# EAGLE design FlipdotMini (EAGLE 6.4)
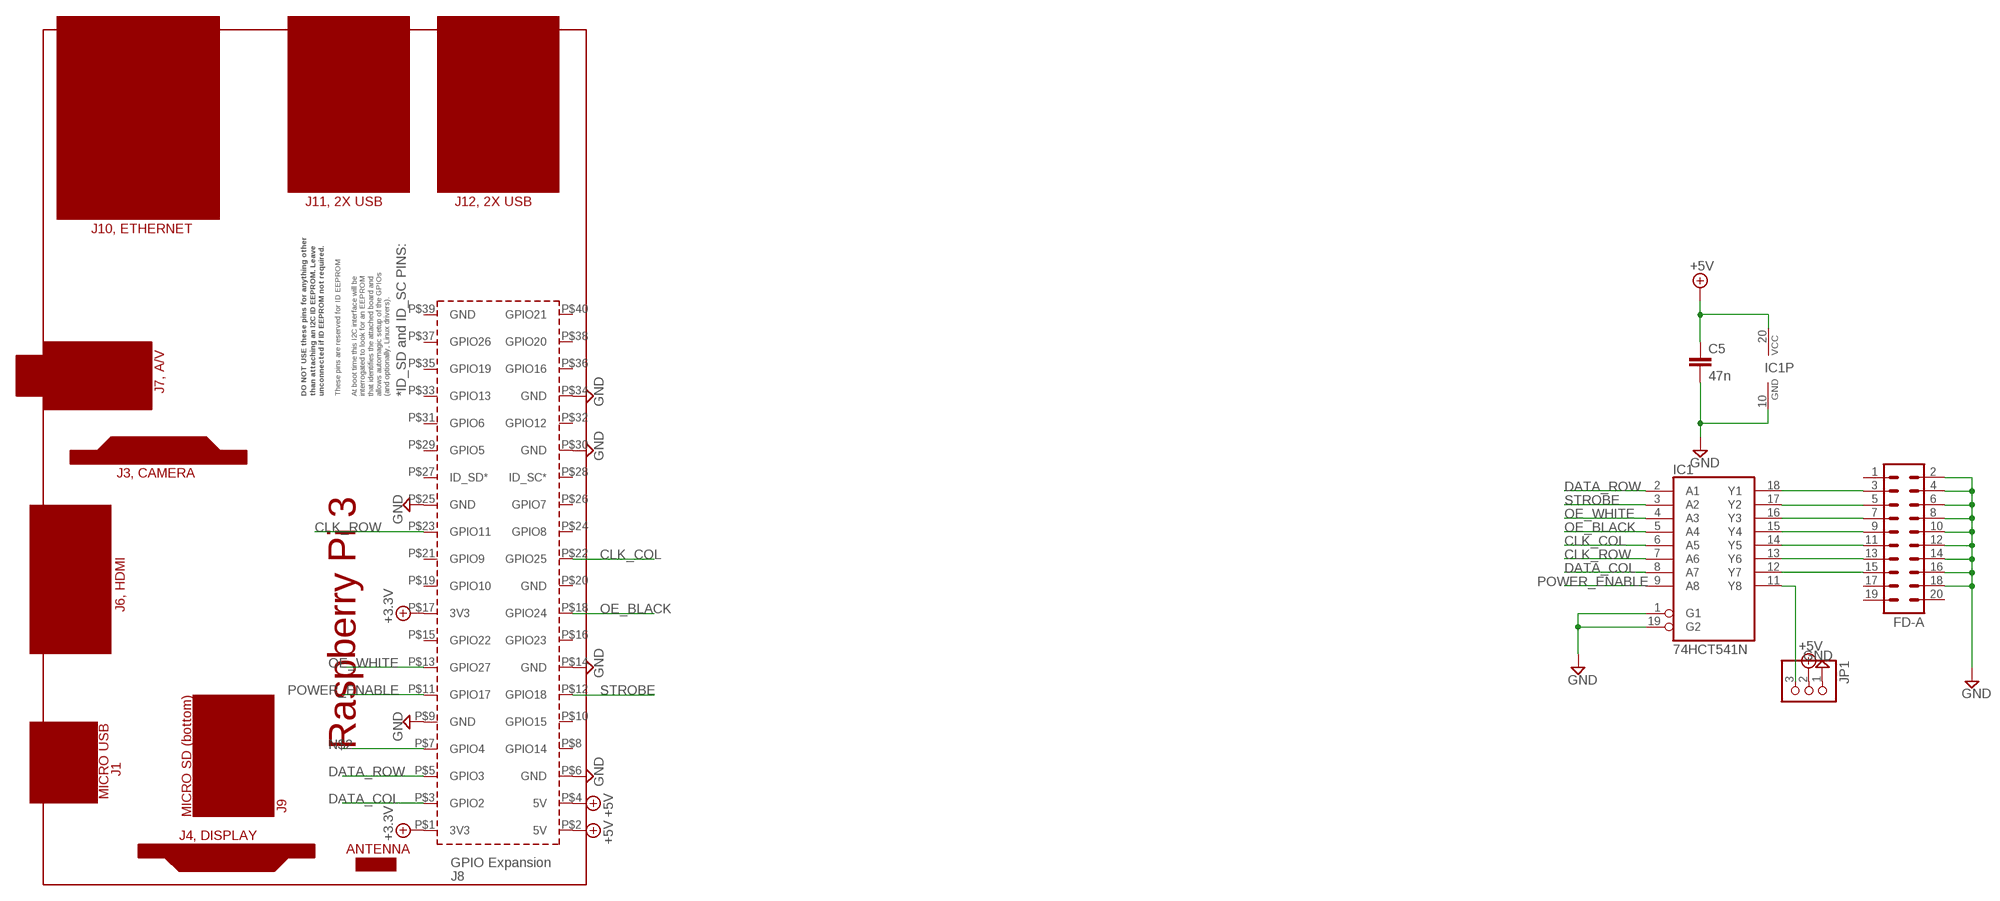
[diagram p0: schematic, sheet 1]

## Parts
C5  47n  C-EUC0805  [C0805]
FD-A  MA10-2  [MA10-2]
IC1  74HCT541N  [DIL20]
JP1  PINHD-1X3  [1X03]
PCB1  RPI3  [RPI3]

## Nets
+3.3V: PCB1.P$1(3V3) PCB1.P$17(3V3)
+5V: C5.1 IC1.20(VCC) JP1.2 PCB1.P$2(5V) PCB1.P$4(5V)
CLK_COL: IC1.6(A5) PCB1.P$22(GPIO25)
CLK_ROW: IC1.7(A6) PCB1.P$23(GPIO11)
DATA_COL: IC1.8(A7) PCB1.P$3(GPIO2)
DATA_ROW: IC1.2(A1) PCB1.P$5(GPIO3)
GND: C5.2 FD-A.2 FD-A.4 FD-A.6 FD-A.8 FD-A.10 FD-A.12 FD-A.14 FD-A.16 FD-A.18 IC1.1(G1) IC1.10(GND) IC1.19(G2) JP1.1 PCB1.P$6(GND) PCB1.P$9(GND) PCB1.P$14(GND) PCB1.P$25(GND) PCB1.P$30(GND) PCB1.P$34(GND)
N$1: FD-A.3 IC1.18(Y1)
N$2: PCB1.P$7(GPIO4)
N$3: FD-A.5 IC1.17(Y2)
N$4: FD-A.7 IC1.16(Y3)
N$5: FD-A.9 IC1.15(Y4)
N$6: FD-A.11 IC1.14(Y5)
N$7: FD-A.13 IC1.13(Y6)
N$8: FD-A.15 IC1.12(Y7)
N$9: IC1.11(Y8) JP1.3
OE_BLACK: IC1.5(A4) PCB1.P$18(GPIO24)
OE_WHITE: IC1.4(A3) PCB1.P$13(GPIO27)
POWER_ENABLE: IC1.9(A8) PCB1.P$11(GPIO17)
STROBE: IC1.3(A2) PCB1.P$12(GPIO18)
Unconnected: FD-A.1 FD-A.17 FD-A.19 FD-A.20 PCB1.P$8(GPIO14) PCB1.P$10(GPIO15) PCB1.P$15(GPIO22) PCB1.P$16(GPIO23) PCB1.P$19(GPIO10) PCB1.P$20(GND) PCB1.P$21(GPIO9) PCB1.P$24(GPIO8) PCB1.P$26(GPIO7) PCB1.P$27(ID_SD*) PCB1.P$28(ID_SC*) PCB1.P$29(GPIO5) PCB1.P$31(GPIO6) PCB1.P$32(GPIO12) PCB1.P$33(GPIO13) PCB1.P$35(GPIO19) PCB1.P$36(GPIO16) PCB1.P$37(GPIO26) PCB1.P$38(GPIO20) PCB1.P$39(GND) PCB1.P$40(GPIO21)

## Library data of the parts
C5 = rcl:C-EU: CAPACITOR, European symbol
FD-A = con-lstb:MA10-2: PIN HEADER; OC_FARNELL: unknown; OC_NEWARK: unknown
IC1 = 74xx-eu:74*541: Octal BUFFER and LINE DRIVER, 3-state
JP1 = pinhead:PINHD-1X3: PIN HEADER
PCB1 = e14_Rpi3_RevA:RPI3: Device for Raspberry Pi 3 board created by Dave Young for www.element14.com More information and support community is available at https://www.element14.com/community/community/raspberry-pi

## Board
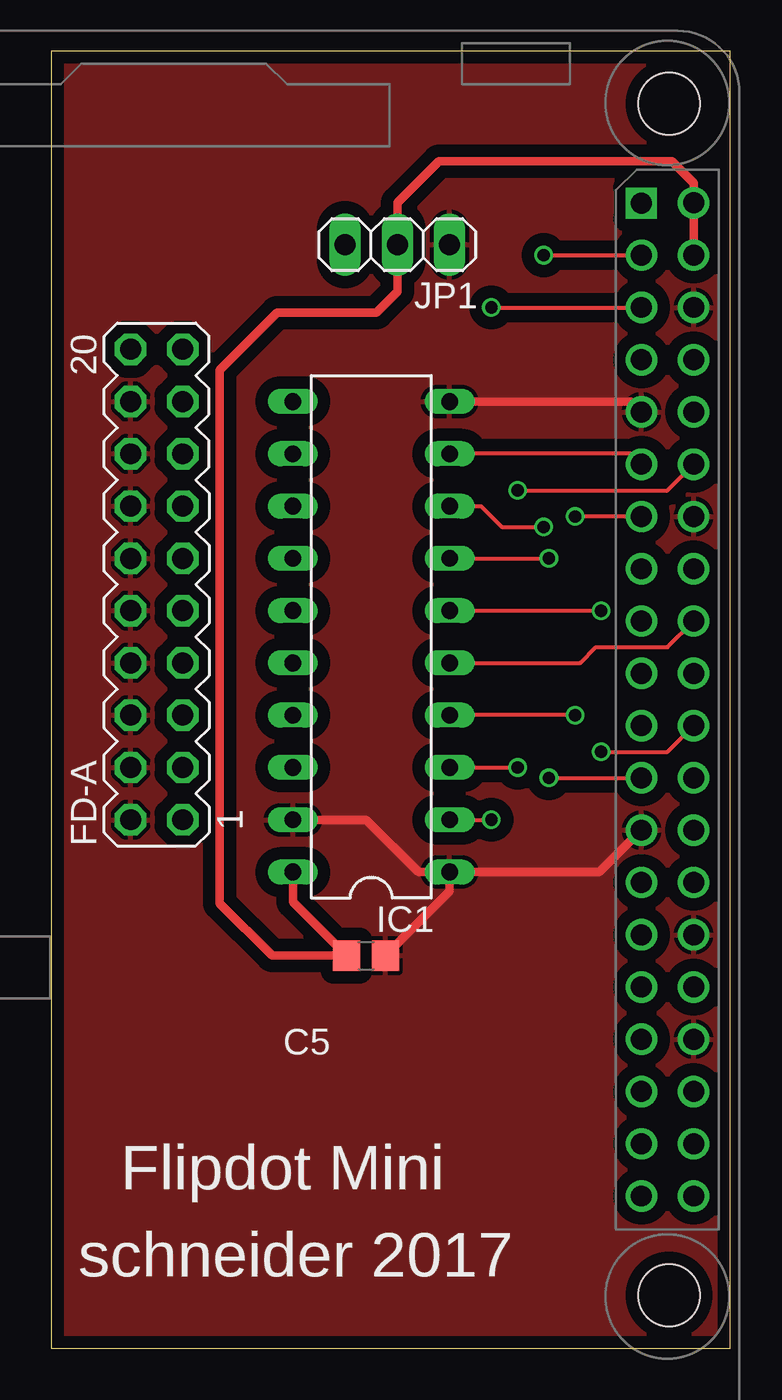
[diagram p1: board, top side]
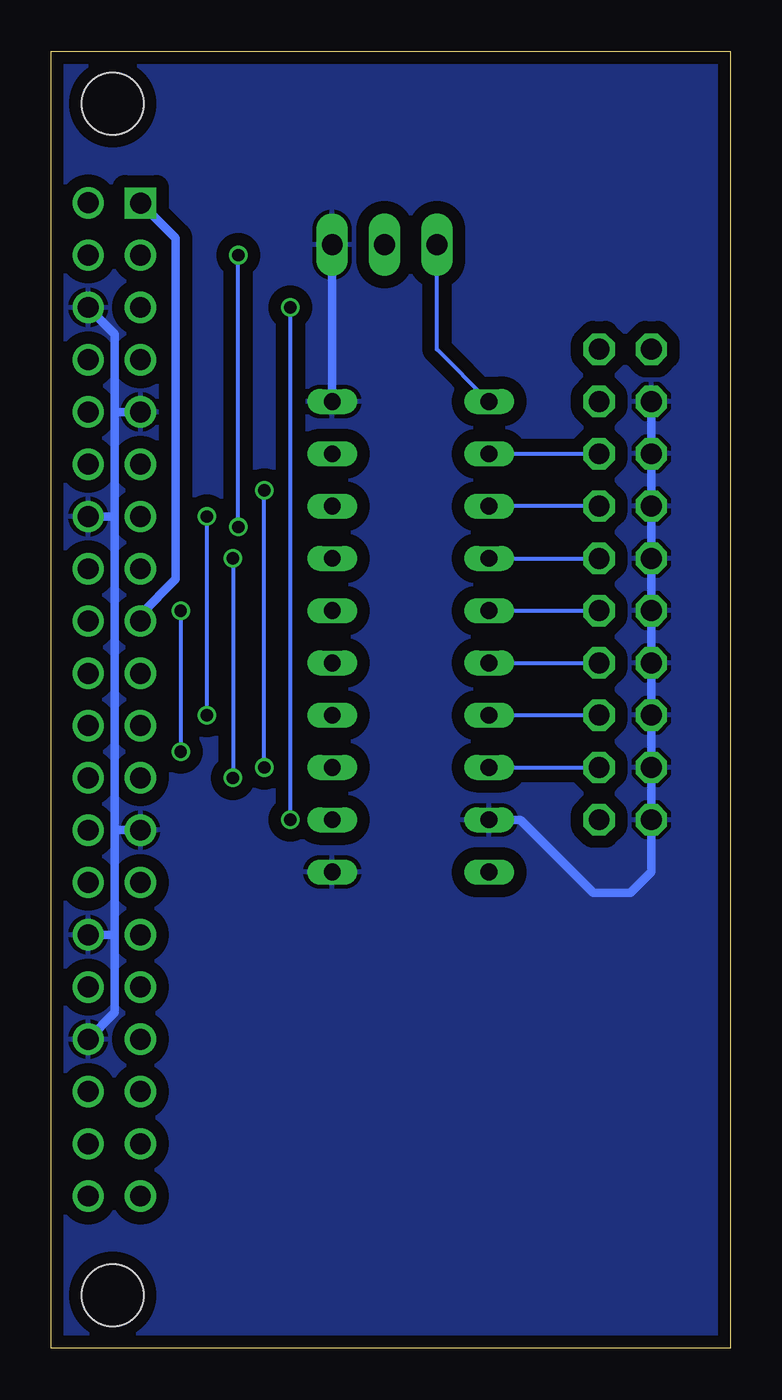
[diagram p2: board, bottom side, seen from below]

Size 33 x 63 mm. Coordinates in mm from the lower left corner, seen from the top.
Outline: 0,0 33,0 33,63 0,63 0,0
Copper layers (1*16): Top 0.018mm / dielectric 1.55mm / Bottom 0.018mm
Design rules "Multi-CB_2L_125um-Tracks_OL35um": minimum track width 0.125mm, minimum drill 0.2mm, track to track 0.125mm, track to pad 0.125mm, pad to pad 0.125mm, via to via 0.125mm, smd to smd 0mil, copper to edge 0.2mm, drill to drill 0.2mm, minimum pad ring 0.125mm, minimum via ring 0.125mm, stop-mask expansion 2mil, vias tented up to drill 0.45mm, thermal gap 0.2mm
Holes 3 mm at 30.02,60.47 30.02,2.56

### Footprints (pad centres in the part's own frame; a part is rotated, then mirrored left to right if it is on the bottom)
C0805 = smd 1.3 x 1.5: 1 -0.95,0; 2 0.95,0
MA10-2 = drill 1.016 octagon: 1 -11.43,-1.27; 2 -11.43,1.27; 3 -8.89,-1.27; 4 -8.89,1.27; 5 -6.35,-1.27; 6 -6.35,1.27; 7 -3.81,-1.27; 8 -3.81,1.27; 9 -1.27,-1.27; 10 -1.27,1.27; 11 1.27,-1.27; 12 1.27,1.27; 13 3.81,-1.27; 14 3.81,1.27; 15 6.35,-1.27; 16 6.35,1.27; 17 8.89,-1.27; 18 8.89,1.27; 19 11.43,-1.27; 20 11.43,1.27
DIL20 = drill 0.813 long: 1 -11.43,-3.81; 2 -8.89,-3.81; 3 -6.35,-3.81; 4 -3.81,-3.81; 5 -1.27,-3.81; 6 1.27,-3.81; 7 3.81,-3.81; 8 6.35,-3.81; 9 8.89,-3.81; 10 11.43,-3.81; 11 11.43,3.81; 12 8.89,3.81; 13 6.35,3.81; 14 3.81,3.81; 15 1.27,3.81; 16 -1.27,3.81; 17 -3.81,3.81; 18 -6.35,3.81; 19 -8.89,3.81; 20 -11.43,3.81
1X03 = drill 1.016 long: 1 -2.54,0; 2 0,0; 3 2.54,0
RPI3 = drill 1.016 square: P$1 8.37,51.23 | drill 1.016: P$2 8.357,53.772; P$3 10.897,51.232; P$4 10.897,53.772; P$5 13.437,51.232; P$6 13.437,53.772; P$7 15.977,51.232; P$8 15.977,53.772; P$9 18.517,51.232; P$10 18.517,53.772; P$11 21.057,51.232; P$12 21.057,53.772; P$13 23.597,51.232; P$14 23.597,53.772; P$15 26.137,51.232; P$16 26.137,53.772; P$17 28.677,51.232; P$18 28.677,53.772; P$19 31.217,51.232; P$20 31.217,53.772; P$21 33.757,51.232; P$22 33.757,53.772; P$23 36.297,51.232; P$24 36.297,53.772; P$25 38.837,51.232; P$26 38.837,53.772; P$27 41.377,51.232; P$28 41.377,53.772; P$29 43.917,51.232; P$30 43.917,53.772; P$31 46.457,51.232; P$32 46.457,53.772; P$33 48.997,51.232; P$34 48.997,53.772; P$35 51.537,51.232; P$36 51.537,53.772; P$37 54.077,51.232; P$38 54.077,53.772; P$39 56.617,51.232; P$40 56.617,53.772

### Placement (x,y rotation side)
C5  15.29,19.07 0 top
FD-A  5.11,37.1 90 top
IC1  15.54,34.56 90 top
JP1  16.81,53.61 180 top
PCB1  -22.56,64 270 top

### Tracks (layer width: path | path; a pad name or v marks a point on that pad's centre or on a via)
+3.3V
  Bottom 0.406: PCB1.P$17 28.67,35.65 26.97,37.35 26.97,53.93 PCB1.P$1
+5V
  Top 0.406: IC1.20 11.73,21.67 C5.1 10.72,19.07 8.18,21.61 8.18,47.51 10.97,50.31 15.8,50.31 16.81,51.32 JP1.2 16.81,55.64 18.84,57.67 30.15,57.67 31.21,56.61 PCB1.P$2 PCB1.P$4
CLK_COL  (via drill 0.6)
  Top 0.203: IC1.6 v26.72,35.83 | v26.72,28.97 29.94,28.97 PCB1.P$22
  Bottom 0.203: v26.72,35.83 v26.72,28.97
CLK_ROW  (via drill 0.6)
  Top 0.203: IC1.7 v24.18,38.37 | v24.18,27.7 PCB1.P$23
  Bottom 0.203: v24.18,38.37 v24.18,27.7
DATA_COL  (via drill 0.6)
  Top 0.203: IC1.8 20.88,40.91 21.89,39.89 v23.92,39.89 | v23.92,53.1 PCB1.P$3
  Bottom 0.203: v23.92,39.89 v23.92,53.1
DATA_ROW  (via drill 0.6)
  Top 0.203: IC1.2 v21.38,25.67 | v21.38,50.56 PCB1.P$5
  Bottom 0.203: v21.38,25.67 v21.38,50.56
GND
  Top 0.406: PCB1.P$25 26.64,23.13 IC1.1 | IC1.10 28.17,45.99 PCB1.P$9 | C5.2 19.35,22.18 IC1.1 | IC1.19 15.29,25.67 17.83,23.13 IC1.1
  Bottom 0.406: PCB1.P$6 29.92,49.27 29.92,45.48 | 29.92,45.48 29.92,40.4 | 29.92,40.4 29.92,25.16 | 29.92,25.16 29.92,20.08 | 29.92,20.08 29.92,16.3 PCB1.P$34 | PCB1.P$30 29.92,20.08 | PCB1.P$14 29.92,40.4 | PCB1.P$9 29.92,45.48 | PCB1.P$25 29.92,25.16 | IC1.19 10.21,25.67 6.65,22.11 4.86,22.11 3.84,23.13 FD-A.2 FD-A.4 FD-A.6 FD-A.8 FD-A.10 FD-A.12 FD-A.14 FD-A.16 FD-A.18 | IC1.10 JP1.1
  pour Bottom (isolate 0.61): 39.61,-2.77 36.69,-3.54 -28.8,-4.54 -27.45,65.57 34.71,65.26 40.56,27.89 42.05,11.69 39.26,8.72 38.91,2.11
  pour Top (isolate 0.61): 39.61,-2.77 36.69,-3.54 -28.8,-4.54 -27.45,65.57 34.71,65.26 40.56,27.89 42.05,11.69 39.26,8.72 38.91,2.11
N$1
  Bottom 0.203: IC1.18 FD-A.3
N$3
  Bottom 0.203: IC1.17 FD-A.5
N$4
  Bottom 0.203: IC1.16 FD-A.7
N$5
  Bottom 0.203: IC1.15 FD-A.9
N$6
  Bottom 0.203: IC1.14 FD-A.11
N$7
  Bottom 0.203: FD-A.13 IC1.13
N$8
  Bottom 0.203: IC1.12 FD-A.15
N$9
  Bottom 0.203: IC1.11 14.27,48.53 JP1.3
OE_BLACK
  Top 0.203: IC1.5 25.7,33.29 26.46,34.05 29.94,34.05 PCB1.P$18
OE_WHITE  (via drill 0.6)
  Top 0.203: PCB1.P$13 v25.45,40.4 | v25.45,30.75 IC1.4
  Bottom 0.203: v25.45,40.4 v25.45,30.75
POWER_ENABLE
  Top 0.203: PCB1.P$11 28.17,43.45 IC1.9
STROBE  (via drill 0.6)
  Top 0.203: IC1.3 v22.65,28.21 | v22.65,41.67 29.94,41.67 PCB1.P$12
  Bottom 0.203: v22.65,28.21 v22.65,41.67

### Text on the board
tPlace: Flipdot Mini | schneider 2017